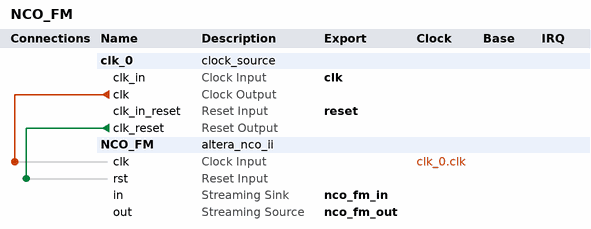
[diagram p0: system contents]
# Platform Designer (Qsys) system NCO_FM, Cyclone V 5CGXFC5C6F27C7
# Parameters at their usual value, and those the tool derives, are not listed.
package require -exact qsys 17.0
create_system NCO_FM
set_project_property DEVICE_FAMILY {Cyclone V}
set_project_property DEVICE 5CGXFC5C6F27C7

add_instance clk_0 clock_source 17.0
set_instance_parameter_value clk_0 clockFrequency 50000000

add_instance NCO_FM altera_nco_ii 17.0
set_instance_parameter_value NCO_FM apr 20
set_instance_parameter_value NCO_FM aprf 11
set_instance_parameter_value NCO_FM apri 16
set_instance_parameter_value NCO_FM arch large_rom
set_instance_parameter_value NCO_FM freq_out 5.0
set_instance_parameter_value NCO_FM fsamp 50.0
set_instance_parameter_value NCO_FM mpr 14
set_instance_parameter_value NCO_FM selected_device_family {Cyclone V}
set_instance_parameter_value NCO_FM want_freq_mod true
set_instance_parameter_value NCO_FM want_sin_and_cos single_output

# connections
add_connection clk_0.clk NCO_FM.clk clock
add_connection clk_0.clk_reset NCO_FM.rst reset

# exported interfaces
add_interface clk clock sink
set_interface_property clk EXPORT_OF clk_0.clk_in
add_interface nco_fm_in avalon_streaming sink
set_interface_property nco_fm_in EXPORT_OF NCO_FM.in
add_interface nco_fm_out avalon_streaming source
set_interface_property nco_fm_out EXPORT_OF NCO_FM.out
add_interface reset reset sink
set_interface_property reset EXPORT_OF clk_0.clk_in_reset

set_interconnect_requirement {$system} qsys_mm.clockCrossingAdapter HANDSHAKE
set_interconnect_requirement {$system} qsys_mm.enableEccProtection FALSE
set_interconnect_requirement {$system} qsys_mm.insertDefaultSlave FALSE
set_interconnect_requirement {$system} qsys_mm.maxAdditionalLatency 1

save_system NCO_FM.qsys
